# EAGLE schematic ADF4351_atmega8 (EAGLE 7.4.0)

## Sheet 1 of 2
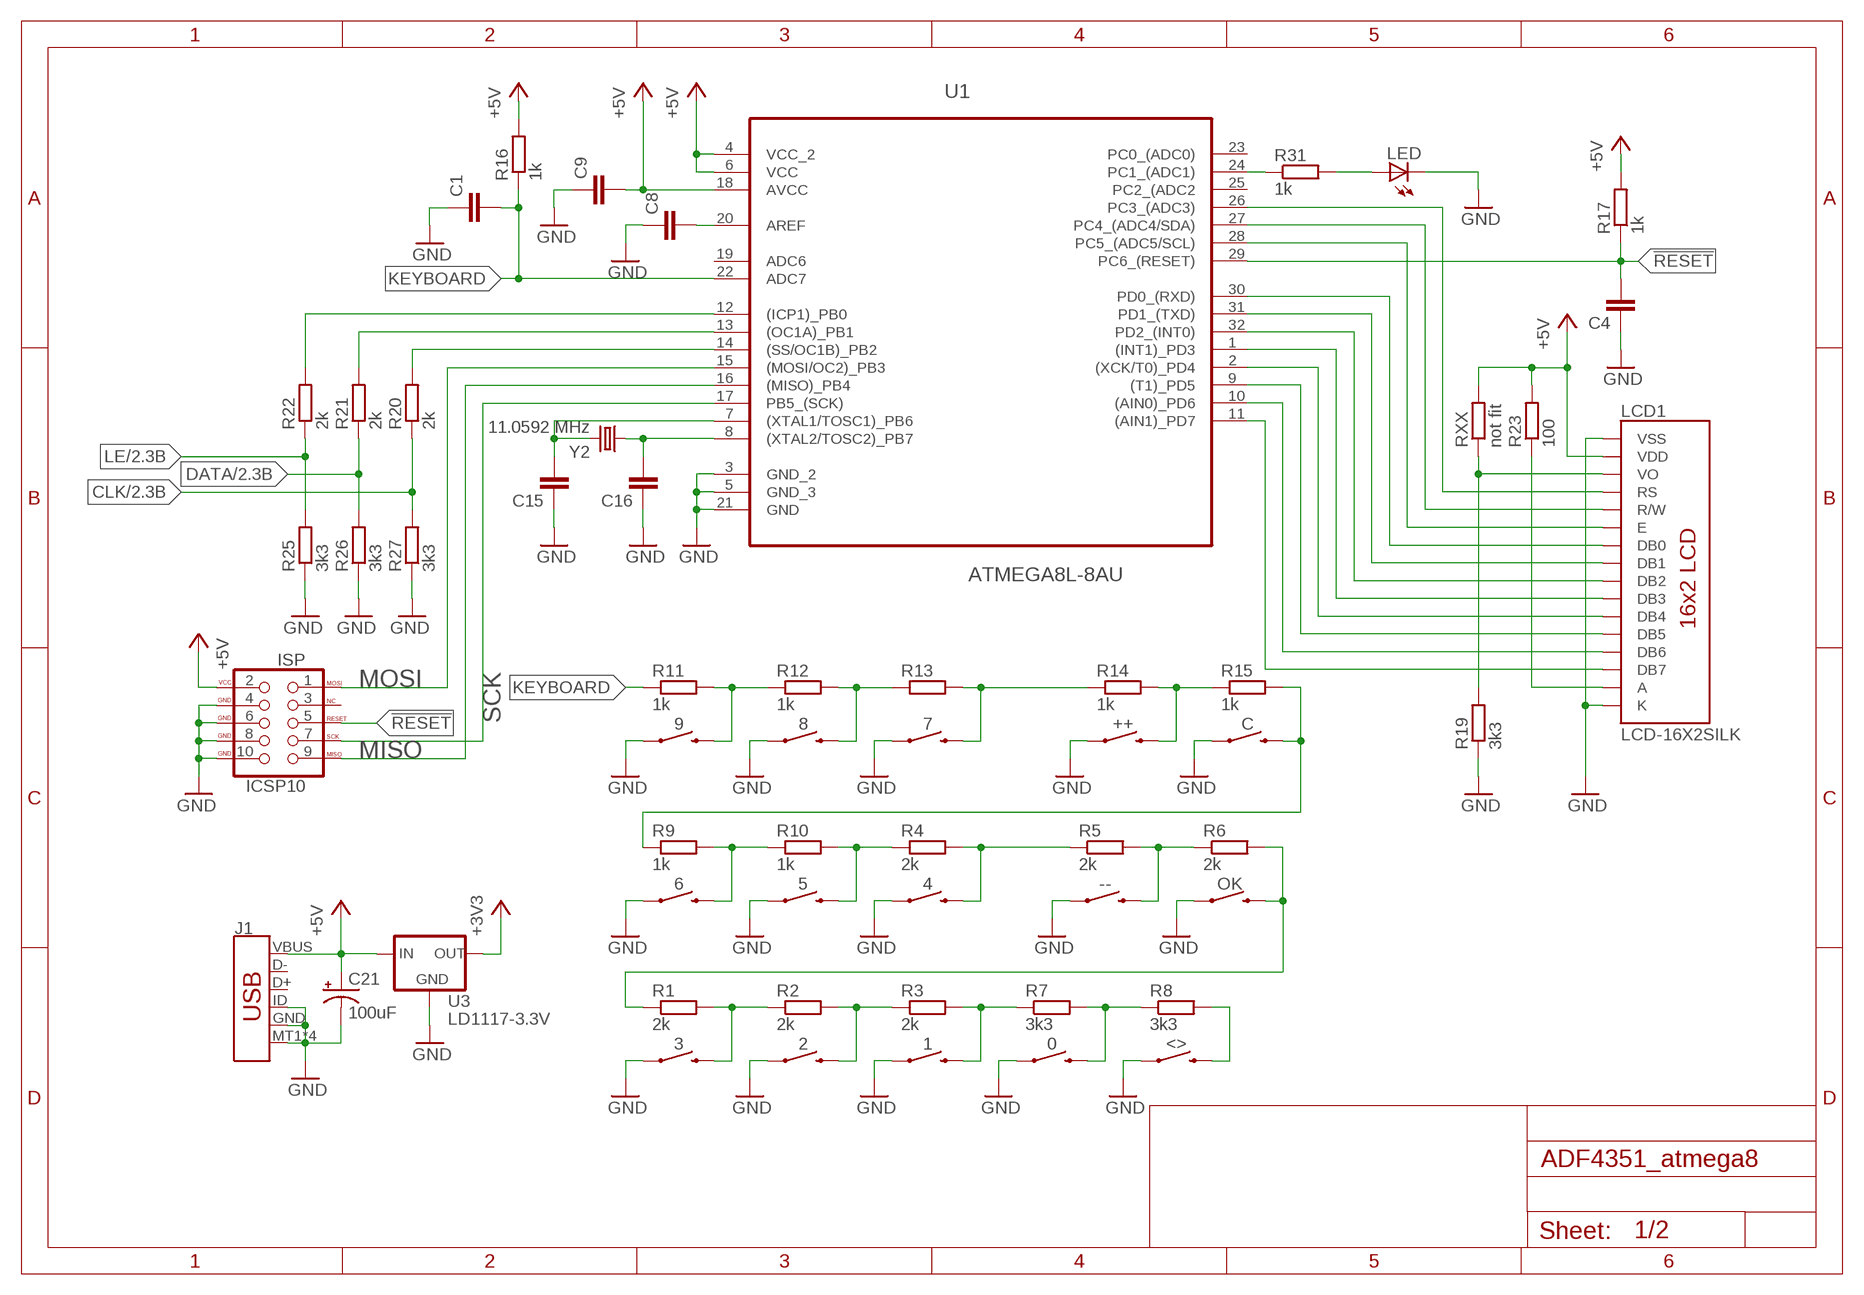
[diagram p0: schematic, sheet 1]

### Parts
0  MOMENTARY-SWITCH-SPST-SMD-6.2MM-TALL  [TACTILE_SWITCH_SMD_6.2MM_TALL]
1  MOMENTARY-SWITCH-SPST-SMD-6.2MM-TALL  [TACTILE_SWITCH_SMD_6.2MM_TALL]
2  MOMENTARY-SWITCH-SPST-SMD-6.2MM-TALL  [TACTILE_SWITCH_SMD_6.2MM_TALL]
3  MOMENTARY-SWITCH-SPST-SMD-6.2MM-TALL  [TACTILE_SWITCH_SMD_6.2MM_TALL]
4  MOMENTARY-SWITCH-SPST-SMD-6.2MM-TALL  [TACTILE_SWITCH_SMD_6.2MM_TALL]
5  MOMENTARY-SWITCH-SPST-SMD-6.2MM-TALL  [TACTILE_SWITCH_SMD_6.2MM_TALL]
6  MOMENTARY-SWITCH-SPST-SMD-6.2MM-TALL  [TACTILE_SWITCH_SMD_6.2MM_TALL]
7  MOMENTARY-SWITCH-SPST-SMD-6.2MM-TALL  [TACTILE_SWITCH_SMD_6.2MM_TALL]
8  MOMENTARY-SWITCH-SPST-SMD-6.2MM-TALL  [TACTILE_SWITCH_SMD_6.2MM_TALL]
9  MOMENTARY-SWITCH-SPST-SMD-6.2MM-TALL  [TACTILE_SWITCH_SMD_6.2MM_TALL]
++  MOMENTARY-SWITCH-SPST-SMD-6.2MM-TALL  [TACTILE_SWITCH_SMD_6.2MM_TALL]
--  MOMENTARY-SWITCH-SPST-SMD-6.2MM-TALL  [TACTILE_SWITCH_SMD_6.2MM_TALL]
<>  MOMENTARY-SWITCH-SPST-SMD-6.2MM-TALL  [TACTILE_SWITCH_SMD_6.2MM_TALL]
C  MOMENTARY-SWITCH-SPST-SMD-6.2MM-TALL  [TACTILE_SWITCH_SMD_6.2MM_TALL]
C1  C-EUC0805  [C0805]
C4  C-EUC0805  [C0805]
C8  C-EUC0805  [C0805]
C9  C-EUC0805  [C0805]
C15  C-EUC0805  [C0805]
C16  C-EUC0805  [C0805]
C21  100uF  CPOL-USE5-5  [E5-5]
ISP  ICSP10  AVR_SPI_PROG_5X2PTH  [2X5]
J1  USB_MICRO-B_SMT  [USB-MICROB]
LCD1  LCD-16X2SILK  [LCD-16X2]
LED  LEDSML0805  [SML0805]
OK  MOMENTARY-SWITCH-SPST-SMD-6.2MM-TALL  [TACTILE_SWITCH_SMD_6.2MM_TALL]
R1  2k  R-EU_R0805  [R0805]
R2  2k  R-EU_R0805  [R0805]
R3  2k  R-EU_R0805  [R0805]
R4  2k  R-EU_R0805  [R0805]
R5  2k  R-EU_R0805  [R0805]
R6  2k  R-EU_R0805  [R0805]
R7  3k3  R-EU_R0805  [R0805]
R8  3k3  R-EU_R0805  [R0805]
R9  1k  R-EU_R0805  [R0805]
R10  1k  R-EU_R0805  [R0805]
R11  1k  R-EU_R0805  [R0805]
R12  1k  R-EU_R0805  [R0805]
R13  R-EU_R0805  [R0805]
R14  1k  R-EU_R0805  [R0805]
R15  1k  R-EU_R0805  [R0805]
R16  1k  R-EU_R0805  [R0805]
R17  1k  R-EU_R0805  [R0805]
R19  3k3  R-EU_R0805  [R0805]
R20  2k  R-EU_R0805  [R0805]
R21  2k  R-EU_R0805  [R0805]
R22  2k  R-EU_R0805  [R0805]
R23  100  R-EU_R0805  [R0805]
R25  3k3  R-EU_R0805  [R0805]
R26  3k3  R-EU_R0805  [R0805]
R27  3k3  R-EU_R0805  [R0805]
R31  1k  R-EU_R0805  [R0805]
RXX  not fit  R-EU_R0805  [R0805]
U1  ATMEGA8L-8AU  [QFP80P900X900X120-32N]
U3  LD1117-3.3V  V_REG_LD1117VXXLD1117-SMD  [SOT223]
Y2  11.0592 MHz  CRYSTALHC49S  [HC49/S]

### Nets
!RESET: C4.2 ISP.5(RESET) R17.1 U1.29(PC6_(RESET))
+3V3: U3.2(OUT) ; also sheet 2
+5V: C9.2 C21.+ ISP.2(VCC) J1.VBUS LCD1.2(VDD) R16.2 R17.2 R23.2 RXX.2 U1.4(VCC_2) U1.6(VCC) U1.18(AVCC) U3.3(IN)
CLK: R20.1 R27.2 ; also sheet 2
DATA: R21.1 R26.2 ; also sheet 2
GND: 0.A2 1.A2 2.A2 3.A2 4.A2 5.A2 6.A2 7.A2 8.A2 9.A2 ++.A2 --.A2 <>.A2 C1.1 C4.1 C8.1 C9.1 C15.1 C16.1 C21.- C.A2 ISP.4(GND) ISP.6(GND) ISP.8(GND) ISP.10(GND) J1.GND J1.ID J1.MT1(SHIELD) J1.MT2(SHIELD) J1.P$1(SHIELD) J1.P$2(SHIELD) LCD1.1(VSS) LCD1.16(K) LED.C OK.A2 R19.1 R25.1 R26.1 R27.1 U1.3(GND_2) U1.5(GND_3) U1.21(GND) U3.1(GND) ; also sheet 2
KEYBOARD: C1.2 R11.1 R16.1 U1.22(ADC7)
LE: R22.1 R25.2 ; also sheet 2
MISO: ISP.9(MISO) U1.16((MISO)_PB4)
MOSI: ISP.1(MOSI) U1.15((MOSI/OC2)_PB3)
N$1: <>.B2 R8.2
N$2: 0.B2 R7.2 R8.1
N$3: 1.B2 R3.2 R7.1
N$4: 2.B2 R2.2 R3.1
N$5: 3.B2 R1.2 R2.1
N$6: --.B2 R5.2 R6.1
N$7: OK.B2 R1.1 R6.2
N$8: 4.B2 R4.2 R5.1
N$9: 5.B2 R4.1 R10.2
N$10: 6.B2 R9.2 R10.1
N$11: 9.B2 R11.2 R12.1
N$12: 8.B2 R12.2 R13.1
N$13: 7.B2 R13.2 R14.1
N$14: ++.B2 R14.2 R15.1
N$15: C.B2 R9.1 R15.2
N$16: C16.2 U1.8((XTAL2/TOSC2)_PB7) Y2.1
N$17: C15.2 U1.7((XTAL1/TOSC1)_PB6) Y2.2
N$18: C8.2 U1.20(AREF)
N$19: R31.1 U1.24(PC1_(ADC1))
N$20: LED.A R31.2
N$21: LCD1.7(DB0) U1.30(PD0_(RXD))
N$22: LCD1.3(VO) R19.2 RXX.1
N$23: LCD1.4(RS) U1.26(PC3_(ADC3))
N$24: LCD1.5(R/W) U1.27(PC4_(ADC4/SDA))
N$25: LCD1.6(E) U1.28(PC5_(ADC5/SCL))
N$26: LCD1.8(DB1) U1.31(PD1_(TXD))
N$27: LCD1.9(DB2) U1.32(PD2_(INT0))
N$28: LCD1.10(DB3) U1.1((INT1)_PD3)
N$29: LCD1.11(DB4) U1.2((XCK/T0)_PD4)
N$30: LCD1.12(DB5) U1.9((T1)_PD5)
N$31: LCD1.13(DB6) U1.10((AIN0)_PD6)
N$32: LCD1.14(DB7) U1.11((AIN1)_PD7)
N$33: LCD1.15(A) R23.1
N$54: R20.2 U1.14((SS/OC1B)_PB2)
N$55: R21.2 U1.13((OC1A)_PB1)
N$56: R22.2 U1.12((ICP1)_PB0)
SCK: ISP.7(SCK) U1.17(PB5_(SCK))
Unconnected: ISP.3(NC) J1.D+ J1.D- U1.19(ADC6) U1.23(PC0_(ADC0)) U1.25(PC2_(ADC2)

## Sheet 2 of 2
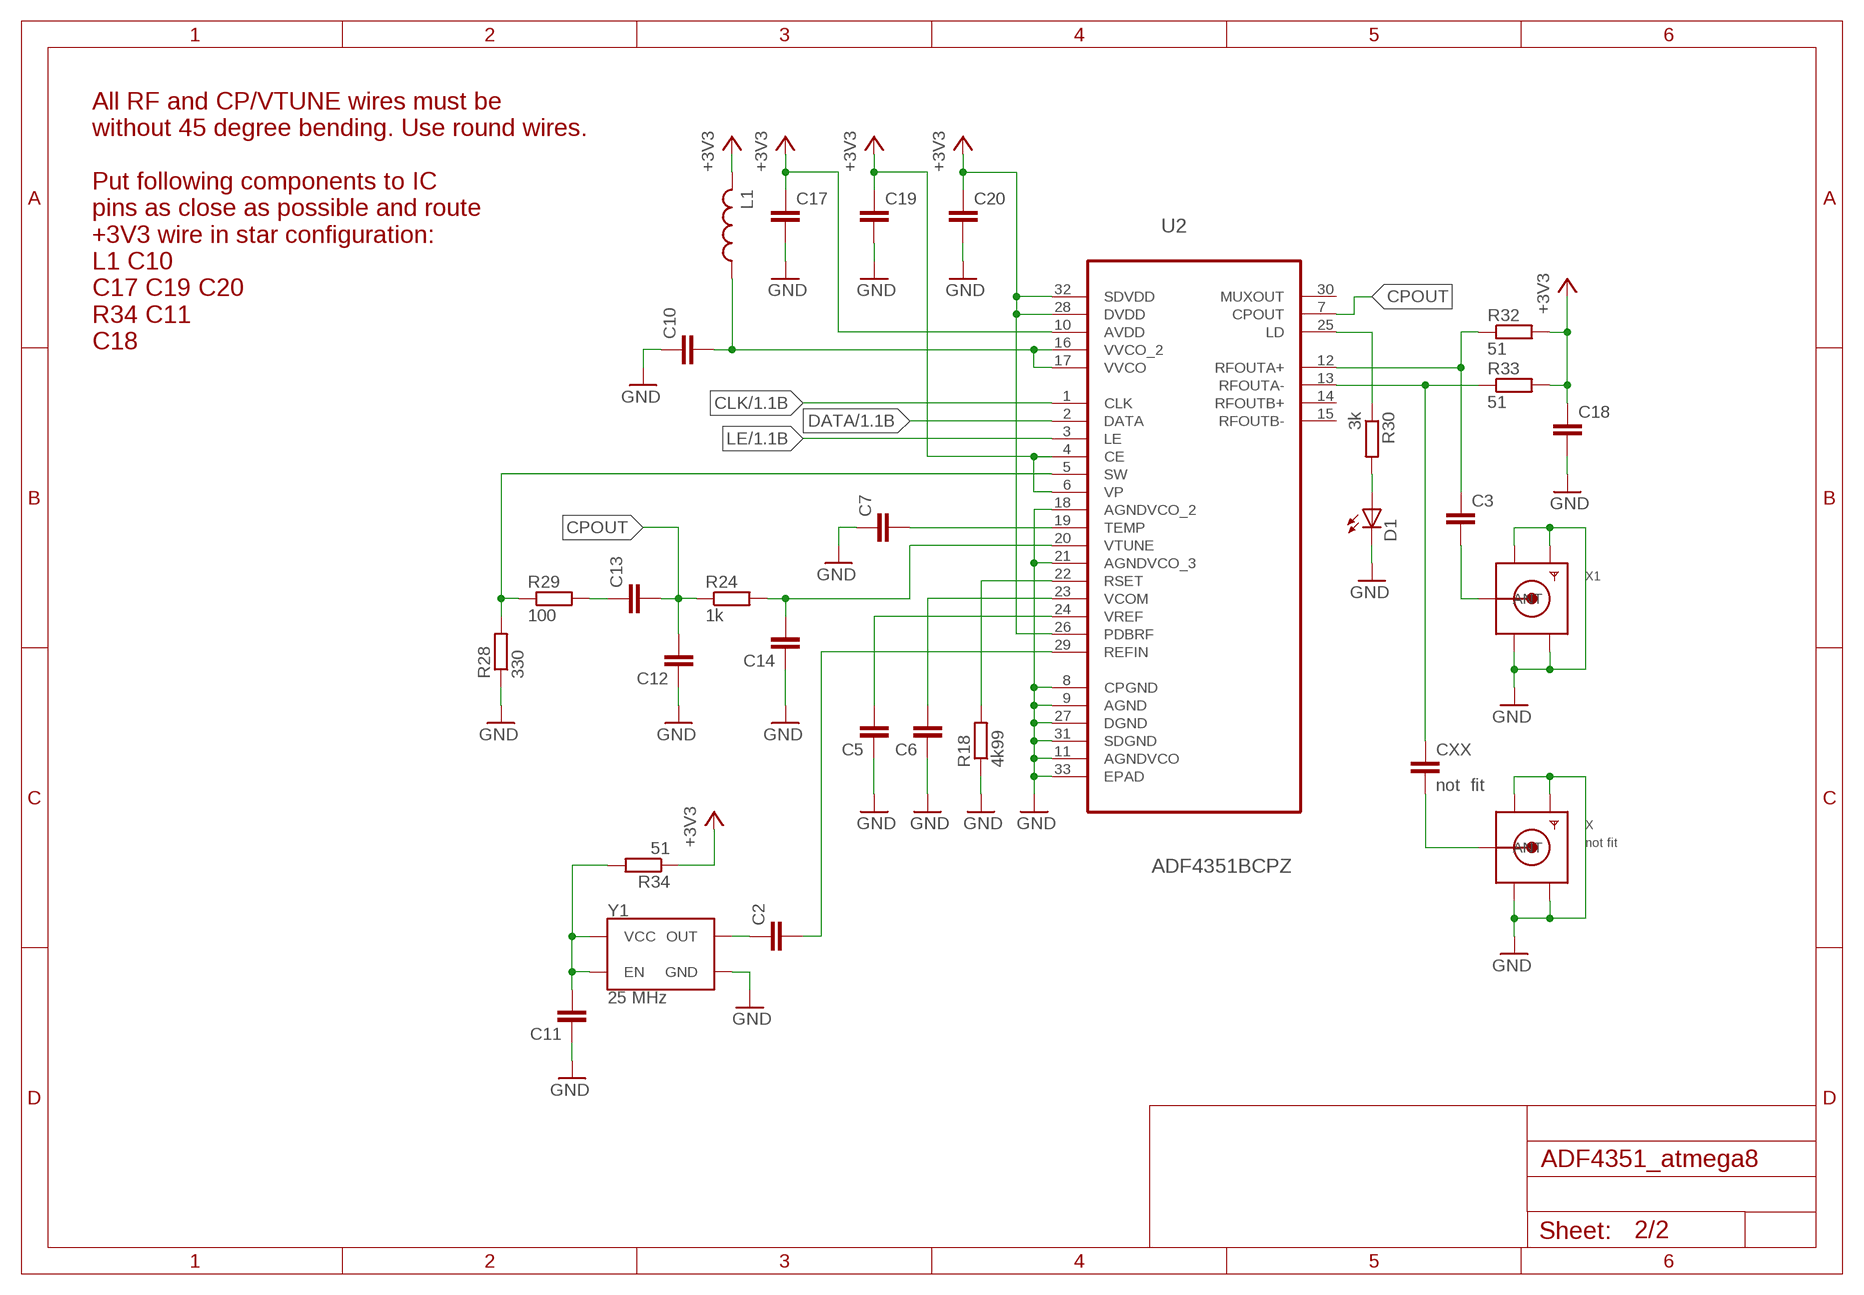
[diagram p1: schematic, sheet 2]

### Parts
C2  C-EUC0805  [C0805]
C3  C-EUC0805  [C0805]
C5  C-EUC0805  [C0805]
C6  C-EUC0805  [C0805]
C7  C-EUC0805  [C0805]
C10  C-EUC0805  [C0805]
C11  C-EUC0805  [C0805]
C12  C-EUC0805  [C0805]
C13  C-EUC0805  [C0805]
C14  C-EUC0805  [C0805]
C17  C-EUC0805  [C0805]
C18  C-EUC0805  [C0805]
C19  C-EUC0805  [C0805]
C20  C-EUC0805  [C0805]
CXX  not fit  C-EUC0805  [C0805]
D1  LEDSML0805  [SML0805]
L1  L-USL2012C  [L2012C]
R18  4k99  R-EU_R0805  [R0805]
R24  1k  R-EU_R0805  [R0805]
R28  330  R-EU_R0805  [R0805]
R29  100  R-EU_R0805  [R0805]
R30  3k  R-EU_R0805  [R0805]
R32  51  R-EU_R0805  [R0805]
R33  51  R-EU_R0805  [R0805]
R34  51  R-EU_R0805  [R0805]
U2  ADF4351BCPZ  [QFN50P500X500X100-33N]
X  not fit  SMACONNECTOR_EDGE  [SMA_EDGELAUNCH]
X1  SMACONNECTOR_EDGE  [SMA_EDGELAUNCH]
Y1  25 MHz  OSCILLATORSMD-7X5-4PAD  [OSCILLATOR-SMD-7X5-4PAD]

### Nets
+3V3: C17.1 C18.1 C19.1 C20.1 L1.2 R32.2 R33.2 R34.1 U2.4(CE) U2.6(VP) U2.10(AVDD) U2.26(PDBRF) U2.28(DVDD) U2.32(SDVDD) ; also sheet 1
CLK: U2.1(CLK) ; also sheet 1
CPOUT: C12.2 C13.2 R24.1 U2.7(CPOUT)
DATA: U2.2(DATA) ; also sheet 1
GND: C5.1 C6.1 C7.1 C10.1 C11.1 C12.1 C14.1 C17.2 C18.2 C19.2 C20.2 D1.C R18.1 R28.1 U2.8(CPGND) U2.9(AGND) U2.11(AGNDVCO) U2.18(AGNDVCO_2) U2.21(AGNDVCO_3) U2.27(DGND) U2.31(SDGND) U2.33(EPAD) X1.GND@1(GND4) X1.GND@2(GND3) X1.GND@3(GND2) X1.GND@4(GND1) X.GND@1(GND4) X.GND@2(GND3) X.GND@3(GND2) X.GND@4(GND1) Y1.2(GND) ; also sheet 1
LE: U2.3(LE) ; also sheet 1
N$34: R30.1 U2.25(LD)
N$38: C7.2 U2.19(TEMP)
N$39: C2.1 Y1.3(OUT)
N$40: C10.2 L1.1 U2.16(VVCO_2) U2.17(VVCO)
N$41: C3.2 X1.P(ANT)
N$42: D1.A R30.2
N$43: C11.2 R34.2 Y1.1(EN) Y1.4(VCC)
N$44: C2.2 U2.29(REFIN)
N$45: C13.1 R29.2
N$46: C3.1 R32.1 U2.12(RFOUTA+)
N$47: CXX.1 R33.1 U2.13(RFOUTA-)
N$48: CXX.2 X.P(ANT)
N$51: R18.2 U2.22(RSET)
N$52: C6.2 U2.23(VCOM)
N$53: C5.2 U2.24(VREF)
N$58: R28.2 R29.1 U2.5(SW)
VTUNE: C14.2 R24.2 U2.20(VTUNE)
Unconnected: U2.14(RFOUTB+) U2.15(RFOUTB-) U2.30(MUXOUT)

### Notes on the sheet
- All RF and CP/VTUNE wires must be
  without 45 degree bending. Use round wires.
  
  Put following components to IC
  pins as close as possible and route
  +3V3 wire in star configuration:
  L1 C10
  C17 C19 C20
  R34 C11
  C18

## Library data of the parts
0 1-9 ++ -- <> C OK = SparkFun-Switches:MOMENTARY-SWITCH-SPST: Momentary Switch (Pushbutton) - SPST Normally-open (NO) SPST momentary switches (buttons, pushbuttons). Variants PTH-12MM - 12mm square, through-hole Momentary Pushbutton Switch - 12mm Square <https://www.sparkfun.com/products/9190> (COM-09190) PTH-6.0MM, PTH-6.0MM-KIT - 6.0mm square, through-hole Mini Pushbutton Switch <https://www.sparkfun.com/products/97> (COM-00097) KIT package intended for soldering kit's - only one side of pads' copper is exposed. PTH-RIGHT-ANGLE-KIT - Right-angle, through-hole Right Angle Tactile Button <https://www.sparkfun.com/products/10791> - Used on SparkFun BigTime Watch Kit <https://www.sparkfun.com/products/11734> SMD-12MM - 12mm square, surface-mount Tactile Button - SMD (12mm) <https://www.sparkfun.com/products/12993> (COM-12993) Used on SparkFun PicoBoard <https://www.sparkfun.com/products/11888> SMD-4.5MM - 4.5mm Square Trackball Switch Used on SparkFun Blackberry Trackballer Breakout <https://www.sparkfun.com/products/13169> SMD-4.6MMX2.8MM - 4.60mm x 2.80mm, surface mount Used on SparkFun SAMD21 Mini Breakout <https://www.sparkfun.com/products/13664> SMD-5.2MM, SMD-5.2-REDUNDANT - 5.2mm square, surface-mount Mini Pushbutton Switch - SMD <https://www.sparkfun.com/products/8720> (COM-08720) Used on Arduino Pro Mini <https://www.sparkfun.com/products/11114> REDUNDANT package connects both switch circuits together SMD-6.0X3.5MM - 6.0 x 3.5mm, surface mount Momentary Reset Switch SMD <https://www.sparkfun.com/products/8229> (COM-08229) SMD-6.2MM-TALL - 6.2mm square, surface mount Tactile Button - SMD (6mm) <https://www.sparkfun.com/products/12992> Used on SparkFun Digital Sandbox <https://www.sparkfun.com/products/12651> SMD-RIGHT-ANGLE - Right-angle, surface mount Used on SparkFun Block for Intel® Edison - Arduino <https://www.sparkfun.com/products/13036>; PROD_ID: SWCH-11966; SF_SKU: COM-12992
C1-C20 CXX = rcl:C-EU: CAPACITOR, European symbol
C21 = rcl:CPOL-US: POLARIZED CAPACITOR, American symbol
D1 LED = led:LED: LED OSRAM: - CHIPLED LG R971, LG N971, LY N971, LG Q971, LY Q971, LO R971, LY R971 LH N974, LH R974 LS Q976, LO Q976, LY Q976 LO Q996 - Hyper CHIPLED LW Q18S LB Q993, LB Q99A, LB R99A - SideLED LS A670, LO A670, LY A670, LG A670, LP A670 LB A673, LV A673, LT A673, LW A673 LH A674 LY A675 LS A676, LA A676, LO A676, LY A676, LW A676 LS A679, LY A679, LG A679 - Hyper Micro SIDELED® LS Y876, LA Y876, LO Y876, LY Y876 LT Y87S - SmartLED LW L88C, LW L88S LB L89C, LB L89S, LG L890 LS L89K, LO L89K, LY L89K LS L896, LA L896, LO L896, LY L896 - TOPLED LS T670, LO T670, LY T670, LG T670, LP T670 LSG T670, LSP T670, LSY T670, LOP T670, LYG T670 LG T671, LOG T671, LSG T671 LB T673, LV T673, LT T673, LW T673 LH T674 LS T676, LA T676, LO T676, LY T676, LB T676, LH T676, LSB T676, LW T676 LB T67C, LV T67C, LT T67C, LS T67K, LO T67K, LY T67K, LW E67C LS E67B, LA E67B, LO E67B, LY E67B, LB E67C, LV E67C, LT E67C LW T67C LS T679, LY T679, LG T679 LS T770, LO T770, LY T770, LG T770, LP T770 LB T773, LV T773, LT T773, LW T773 LH T774 LS E675, LA E675, LY E675, LS T675 LS T776, LA T776, LO T776, LY T776, LB T776 LHGB T686 LT T68C, LB T68C - Hyper Mini TOPLED® LB M676 - Mini TOPLED Santana® LG M470 LS M47K, LO M47K, LY M47K Source: http://www.osram.convergy.de LUXEON: - LUMILED® LXK2-PW12-R00, LXK2-PW12-S00, LXK2-PW14-U00, LXK2-PW14-V00 LXK2-PM12-R00, LXK2-PM12-S00, LXK2-PM14-U00 LXK2-PE12-Q00, LXK2-PE12-R00, LXK2-PE12-S00, LXK2-PE14-T00, LXK2-PE14-U00 LXK2-PB12-K00, LXK2-PB12-L00, LXK2-PB12-M00, LXK2-PB14-N00, LXK2-PB14-P00, LXK2-PB14-Q00 LXK2-PR12-L00, LXK2-PR12-M00, LXK2-PR14-Q00, LXK2-PR14-R00 LXK2-PD12-Q00, LXK2-PD12-R00, LXK2-PD12-S00 LXK2-PH12-R00, LXK2-PH12-S00 LXK2-PL12-P00, LXK2-PL12-Q00, LXK2-PL12-R00 Source: www.luxeon.com KINGBRIGHT: KA-3528ASYC Source: www.kingbright.com
ISP = SparkFun-Connectors:AVR_SPI_PROG_5X2: AVR 10-pin ICSP Header This is the standard AVR In Circuit Serial Programming header. Minimal, but includes pin one indicator. Works with standard Olimex programmers. SparkFun Products: 2x5 AVR ICSP Male Header <https://www.sparkfun.com/products/778> - PTH 2x5 Pin Shrouded Header <https://www.sparkfun.com/products/8506> - PTH2
J1 = SparkFun-Connectors:USB_MICRO-B: USB Type Micro-B Connector Male/female and PTH/SMT variants SparkFun Products: SparkFun microB USB Breakout <https://www.sparkfun.com/products/12035> SparkFun USB microB Plug Breakout <https://www.sparkfun.com/products/10031> SparkFun ESP8266 Thing <https://www.sparkfun.com/products/13231>; PROD_ID: CONN-09505; SF_ID: PRT-08533
L1 = rcl:L-US: INDUCTOR, American symbol
LCD1 = SparkFun-Displays:LCD-16X2: Standard text-only 16x2 parallel input LCD Basic 16 character by 2 line display. Typically utilizes the extremely common HD44780 parallel interface chipset SparkFun Products: Basic 16x2 Green <https://www.sparkfun.com/products/255> Basic 8x2 Green <https://www.sparkfun.com/products/11122>; PROD_ID: LCD-12633; SF_ID: LCD-00255
R1-R34 RXX = rcl:R-EU_: RESISTOR, European symbol
U1 = Atmel_By_element14_Batch_1-00:ATMEGA8L-8AU: 8-bit with 8KBytes In-System Programmable Flash; MPN: ATMEGA8L-8AU; OC_FARNELL: 9171525; OC_NEWARK: 68T3210; PACKAGE: QFP-32; SUPPLIER: Atmel
U2 = ADF4351BCPZ:ADF4351BCPZ: Wideband Synthesizer with Integrated VCO; MPN: ADF4351BCPZ; PACKAGE: QFN-32; SUPPLIER: Analog Devices
U3 = SparkFun-IC-Power:V_REG_LD1117VXX: LD1117VXX voltage regulator. We carry the 3.3V version (COM-00526) in TO-220 package.; PROD_ID: VREG-13917
X X1 = adafruit:SMACONNECTOR: SMA Connector 90° DIP SMA Connector, 50 Ohm (4UConnector: 07259)
Y1 = SparkFun-Clocks:OSCILLATOR: Oscillators (Generic) These are active oscillators, which require a power source to generate their clock output. Most oscillators are configured to generate a set frequency (e.g. 16MHz). They have four pins: power, ground, output, and an enable input.
Y2 = crystal:CRYSTAL: CRYSTAL; OC_FARNELL: 1667008; OC_NEWARK: unknown